# EAGLE design brakeBoard (EAGLE 9.6.2)
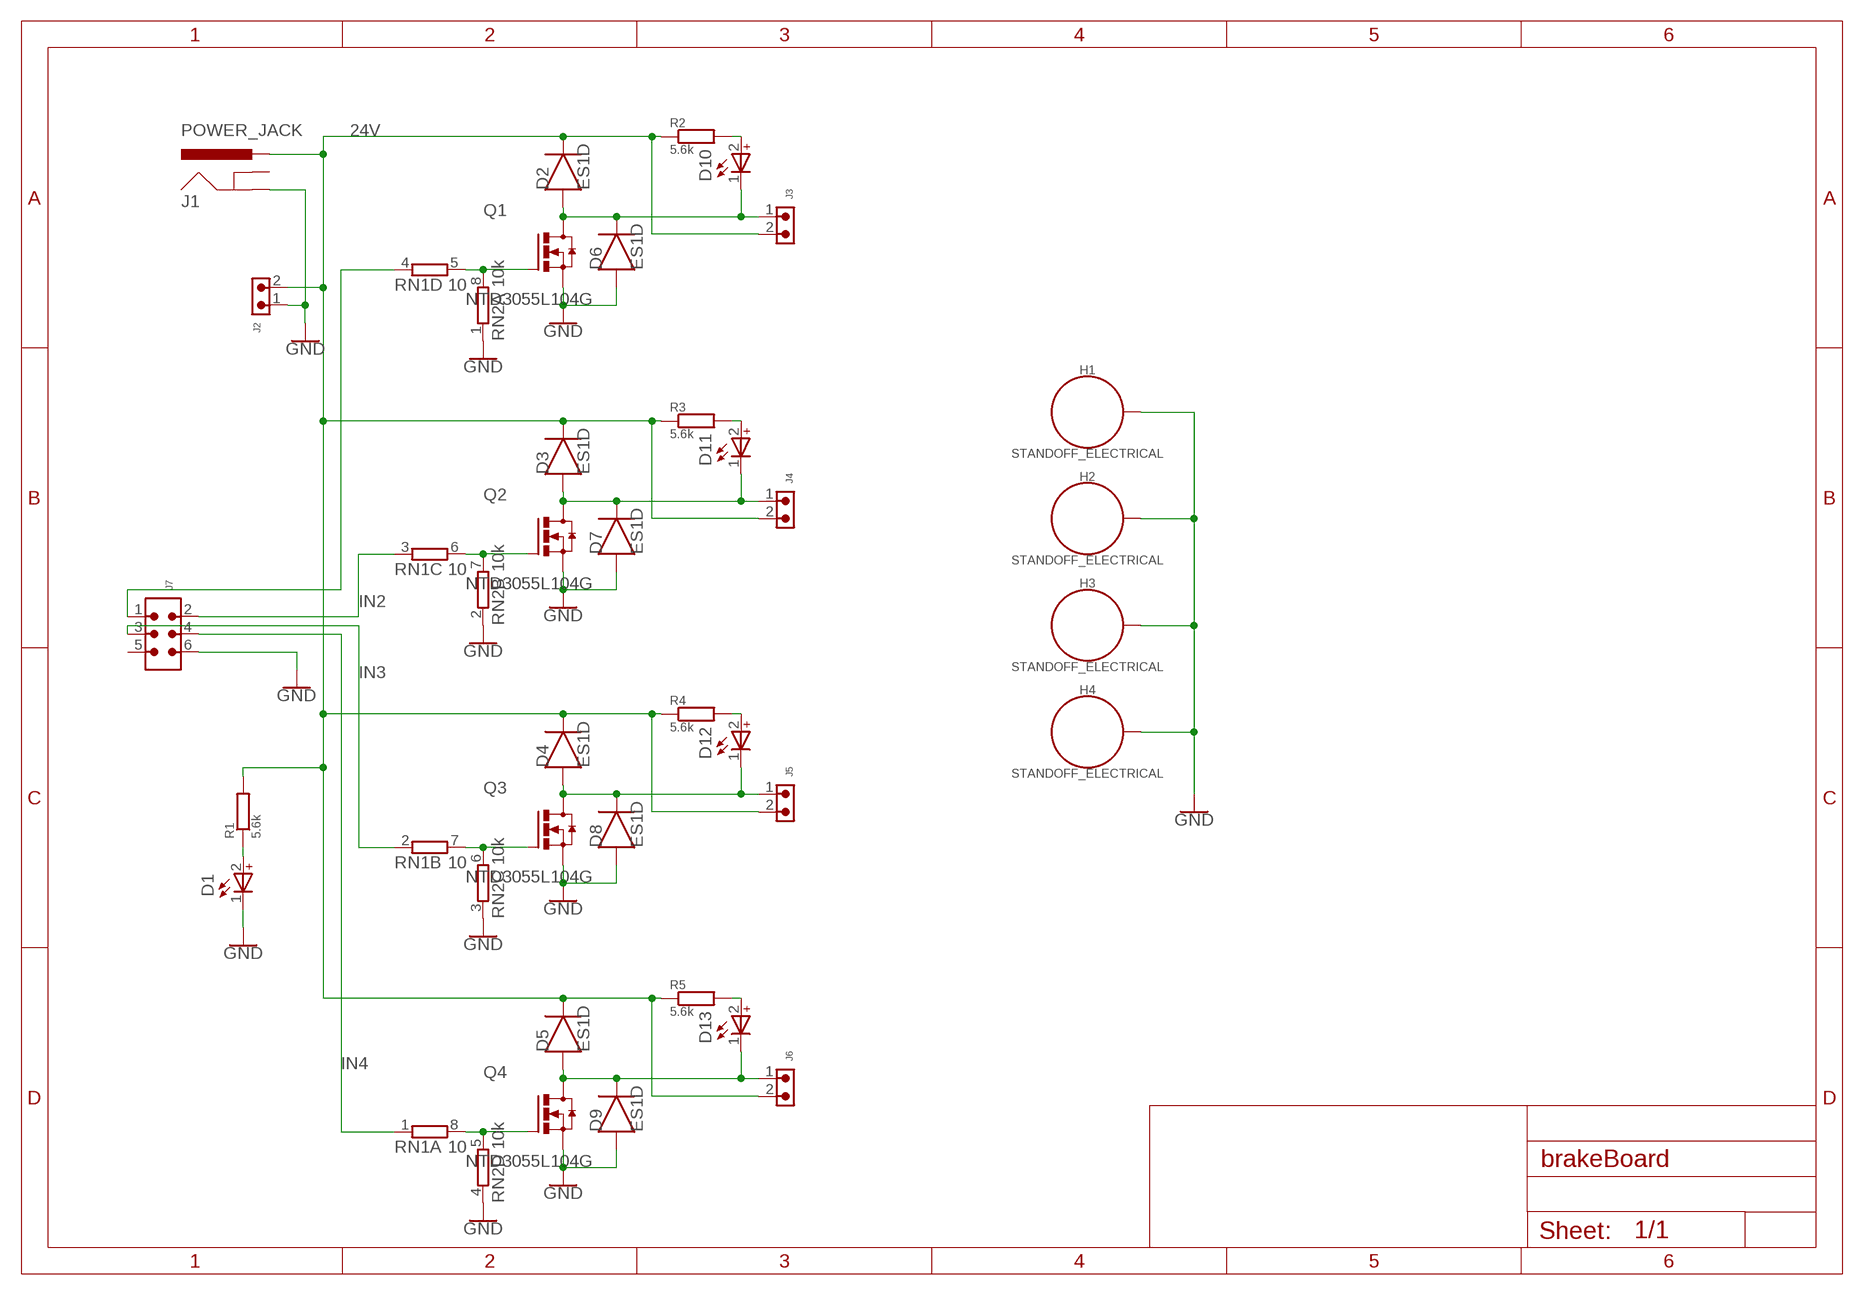
[diagram p0: schematic, sheet 1]

## Parts
D1  WL-SMCD_0603_150060GS55040  [WL-SMCD_0603]
D2  ES1D  DIODE_ES1D_SMA  [DIOM5226X290N]
D3  ES1D  DIODE_ES1D_SMA  [DIOM5226X290N]
D4  ES1D  DIODE_ES1D_SMA  [DIOM5226X290N]
D5  ES1D  DIODE_ES1D_SMA  [DIOM5226X290N]
D6  ES1D  DIODE_ES1D_SMA  [DIOM5226X290N]
D7  ES1D  DIODE_ES1D_SMA  [DIOM5226X290N]
D8  ES1D  DIODE_ES1D_SMA  [DIOM5226X290N]
D9  ES1D  DIODE_ES1D_SMA  [DIOM5226X290N]
D10  WL-SMCD_0603_150060GS55040  [WL-SMCD_0603]
D11  WL-SMCD_0603_150060GS55040  [WL-SMCD_0603]
D12  WL-SMCD_0603_150060GS55040  [WL-SMCD_0603]
D13  WL-SMCD_0603_150060GS55040  [WL-SMCD_0603]
H1  STANDOFF_ELECTRICAL  [STANDOFF-ELECTRICAL]
H2  STANDOFF_ELECTRICAL  [STANDOFF-ELECTRICAL]
H3  STANDOFF_ELECTRICAL  [STANDOFF-ELECTRICAL]
H4  STANDOFF_ELECTRICAL  [STANDOFF-ELECTRICAL]
J1  POWER_JACK  [POWER_JACK_PTH]
J2  691322310002  [691322310002]
J3  691321300002  [691321300002]
J4  691321300002  [691321300002]
J5  691321300002  [691321300002]
J6  691321300002  [691321300002]
J7  6120XX21621_61200621621  [61200621621]
Q1  NTD3055L104G  [DPAK3]
Q2  NTD3055L104G  [DPAK3]
Q3  NTD3055L104G  [DPAK3]
Q4  NTD3055L104G  [DPAK3]
R1  5.6k  R_CHIP-0805(2012-METRIC)  [RESC2012X65]
R2  5.6k  R_CHIP-0805(2012-METRIC)  [RESC2012X65]
R3  5.6k  R_CHIP-0805(2012-METRIC)  [RESC2012X65]
R4  5.6k  R_CHIP-0805(2012-METRIC)  [RESC2012X65]
R5  5.6k  R_CHIP-0805(2012-METRIC)  [RESC2012X65]
RN1  10  4R-NCAY16_LONG_W  [CAY16_LONG_W]
RN2  10k  4R-NCAY16_LONG_W  [CAY16_LONG_W]

## Nets
24V: D2.1(C) D3.1(C) D4.1(C) D5.1(C) J1.PWR J2.2 J3.2 J4.2 J5.2 J6.2 R1.2 R2.1 R3.1 R4.1 R5.1
GND: D1.1(_) D6.2(A) D7.2(A) D8.2(A) D9.2(A) H1.P1 H2.P1 H3.P1 H4.P1 J1.GND J2.1 J7.6 Q1.2(S) Q2.2(S) Q3.2(S) Q4.2(S) RN2.1 RN2.2 RN2.3 RN2.4
IN1: J7.1 RN1.4
IN2: J7.2 RN1.3
IN3: J7.3 RN1.2
IN4: J7.4 RN1.1
N$1: D2.2(A) D6.1(C) D10.1(_) J3.1 Q1.3(D)
N$3: D10.2(+) R2.2
N$4: Q1.1(G) RN1.5 RN2.8
N$5: D3.2(A) D7.1(C) D11.1(_) J4.1 Q2.3(D)
N$7: D11.2(+) R3.2
N$8: D4.2(A) D8.1(C) D12.1(_) J5.1 Q3.3(D)
N$10: D12.2(+) R4.2
N$11: D5.2(A) D9.1(C) D13.1(_) J6.1 Q4.3(D)
N$13: D13.2(+) R5.2
N$14: Q4.1(G) RN1.8 RN2.5
N$15: Q3.1(G) RN1.7 RN2.6
N$16: Q2.1(G) RN1.6 RN2.7
N$17: D1.2(+) R1.1
Unconnected: J1.GNDBREAK J7.5

## Library data of the parts
D1 D10-D13 = Wurth_LEDs_WL-SMCD:WL-SMCD_0603: WL-SMCD SMT Mono-color Chip LED Diffused Characteristics Industrial 0603 platform – 1.6 x 0.8 mm Wide viewing angle 140° Thin version: 0.4 mm Applications Office Automation Home appliances Industrial equipment Front panel backlighting Button backlighting LCD backlighting Navigation backlighting <https://www.we-online.com/catalog/media/o121399v209%20Family_WL-SMCD_0603_thin_0,4mm_150060xx55040.jpg> Details see: https://www.we-online.com/catalog/en/WL-SMCD/ Updated By Yingchun Shan 2020-03-18 2020 (C) Wurth Elektronik; ABSTRAHLWINKEL: 140°; CHIP-TECHNOLOGY: InGaN; DATASHEET-URL: https://www.we-online.com/catalog/datasheet/150060GS55040.pdf; EMITTING-COLOR: Green; I-V-TYP: 430mcd; LAMDA-DOM-TYP: 525nm; LAMDA-PEAK-TYP: 520nm; PART-NUMBER: 150060GS55040; V-F-TYP: 3.2V
D2-D9 = Diode:DIODE_: Diode Rectifier - Popular parts; CATEGORY: Diode; DESCRIPTION: DIODE GEN PURP 200V 1A SMA; MANUFACTURER: ON Semiconductor; SUB-CATEGORY: Rectifier
H1-H4 = SparkFun-Hardware:STANDOFF_ELECTRICAL: Stand Off Drill holes with an electrical connection. For example, use these to ground your board to a chassis. Example SparkFun Products Screw - Phillips Head (1/4", 4-40, 10 pack) <https://www.sparkfun.com/products/10453> (PRT-10453) Screw - Phillips Head (1/2", 4-40, 10 pack) <https://www.sparkfun.com/products/10452> (PRT-10452) Screw - Phillips Head (3/4", 4-40, 10 pack) <https://www.sparkfun.com/products/10451> (PRT-10451) Screw - Phillips Head (1", 4-40, 10 pack) <https://www.sparkfun.com/products/10450> (PRT-10450)
J1 = SparkFun-Connectors:POWER_JACK: Power Jack Connector This is the standard 5.5mm barrel jack for power. The PTH is the most common, proven, reliable, footprint. The Slot footprint only works if the mill layer is transmitted to the PCB fab house so be warned. Here are the connectors we sell at SparkFun: DC Barrel Power Jack/Connector <https://www.sparkfun.com/products/119> (PRT-00119) DC Barrel Power Jack/Connector (SMD) <https://www.sparkfun.com/products/12748> (PRT-12748) DC Barrel Jack Adapter - Breadboard Compatible <https://www.sparkfun.com/products/10811> (PRT-10811) It is used on this SparkFun product (and many, many others): SparkFun RedBoard - Programmed with Arduino <https://www.sparkfun.com/products/12757> (DEV-12757) Also, if you need a mating power supply or connector, please check these out: Wall Adapter Power Supply - 9VDC 650mA <https://www.sparkfun.com/products/298> (TOL-00298) DC Barrel Jack Adapter - Male <https://www.sparkfun.com/products/10287> (PRT-10287); PROD_ID: CONN-08197
J2 = Wurth_Connectors_WR-TBL Pluggable Connector:691322310002: WR-TBL Serie 322 - 3.81 mm Horizontal PCB Header KIND PROPERTIES Pitch 3.81 mm MATERIAL PROPERTIES Insulator Material PA66 Insulator Flammability Rating UL94 V-0 Contact Material Brass Contact Plating Tin GENERAL INFORMATION Operating Temperature -40 up to +105 °C Compliance RoHS ELECTRICAL PROPERTIES IR cULus 10 A IR VDE 10.5 A Working Voltage [cULus] 300 V (AC) Working Voltage [VDE] 300 V (AC) Withstanding Voltage [cULus] 1600 V (AC) Withstanding Voltage [VDE] 2500 V (AC) Contact Resistance [cULus] 20 mΩ Contact Resistance [VDE] 20 mΩ CERTIFICATION cULus Approval E315414 VDE Approval 40023195 <https://www.we-online.com/catalog/media/o33277v209%20Family_WR-TBL_6913223100xx.jpg> Details see: https://www.we-online.com/catalog/en/TBL_3_81_322_HORIZONTAL_PCB_HEADER_6913223100XX/ Updated by Ella Wu 2019-12-20 2019(C) Wurth Elektronik; DATASHEET-URL: https://www.we-online.com/catalog/datasheet/691322310002.pdf; IR-UL: 10A; IR-VDE: 10.5A; MOUNT: THT; PART-NUMBER: 691322310002; PINS: 2; PITCH: 3.81mm; TYPE: Horizontal; WORKING-VOLTAGE-UL: 300V (AC); WORKING-VOLTAGE-VDE: 300V (AC)
J3-J6 = Wurth_Connectors_WR-TBL Pluggable Connector:691321300002: WR-TBL Serie 321 - 3.81 mm Vertical PCB Header KIND PROPERTIES Pitch 3.81 mm MATERIAL PROPERTIES Insulator Material PA66 Insulator Flammability Rating UL94 V-0 Contact Material Brass Contact Plating Tin GENERAL INFORMATION Operating Temperature -40 up to +105 °C Compliance RoHS ELECTRICAL PROPERTIES IR cULus 10 A IR VDE 10.5 A Working Voltage [cULus] 300 V (AC) Working Voltage [VDE] 300 V (AC) Withstanding Voltage [cULus] 1600 V (AC) Withstanding Voltage [VDE] 2500 V (AC) Contact Resistance [cULus] 20 mΩ Contact Resistance [VDE] 20 mΩ CERTIFICATION cULus Approval E315414 VDE Approval 40023195 <https://www.we-online.com/catalog/media/o33275v209%20Family_WR-TBL_6913213000xx.jpg> Details see: https://www.we-online.com/catalog/en/TBL_3_81_321_VERTICAL_PCB_HEADER_6913213000XX/ Updated by Ella Wu 2019-12-18 2019(C) Wurth Elektronik; DATASHEET-URL: https://www.we-online.com/catalog/datasheet/691321300002.pdf; IR-UL: 10A; IR-VDE: 10.5A; MOUNT: THT; PART-NUMBER: 691321300002; PINS: 2; PITCH: 3.81mm; TYPE: Vertical; WORKING-VOLTAGE-UL: 300V (AC); WORKING-VOLTAGE-VDE: 300V (AC)
J7 = Wurth_Connectors_WR-BHD:6120XX21621_61200621621: WR-BHD 2.54 mm Male Box Header KIND PROPERTIES: Pitch 2.54 mm Gender:Male MATERIAL PROPERTIES: Insulator Material:PBT Insulator Flammability Rating UL94 V-0 Insulator Color:Black Contact Material :Copper Alloy Contact Plating :Gold Contact Type: Stamped GENERAL INFORMATION: Operating Temperature:-40 °C up to +125 °C Compliance:RoHS Working Voltage: 250 V (AC) Withstanding Voltage:500 V (AC) Contact Resistance: 20 mΩ Insulation Resistance:1000 MΩ CERTIFICATION: UL Approval:E323964 PACKAGING PROPERTIES Packaging :Tray <https://katalog.we-online.com/media/images/v2/o32884v209%20Family_WR-BHD_6120xx21621.jpg> Details see: https://katalog.we-online.com/en/em/BHD_2_54_MALE_BOX_HEADER_6120XX21621 Updated by Yingchun,Shan 2019-10-29 2019 (C) Würth Elektronik; CONTACT-RESISTANCE: 20mOhm; DATASHEET-URL: https://katalog.we-online.com/em/datasheet/61200621621.pdf; GENDER: Male; IR: 3A; L: 15.28mm; MATES: WR-BHD 2.54mm Female IDC Connector with Strain Relief; MOUNT: THT; PACKAGING: Tray; PART-NUMBER: 61200621621; PINS: 6; PITCH: 2.54mm; TOL-R: max.; TYPE: Straight; WORKING-VOLTAGE: 250V(AC)
Q1-Q4 = Transistor:NTD3055L104G: 12 A, 60 V, Logic Level N−Channel DPAK/IPAK Manufacturer's datasheet <https://www.onsemi.com/pub/Collateral/NTD3055L104-D.PDF>; CREATED_BY: PCBLayout.com; MANUFACTURER: ON SEMICONDUCTORS; MPN: NTD3055L104G; PACKAGE: DPAK-4
R1-R5 = Resistor:R: Resistor Fixed - Generic; CATEGORY: Resistor; SUB-CATEGORY: Fixed
RN1 RN2 = _kantaParts:4R-N: Array Chip Resistor Source: RS Component / Phycomp

## Board
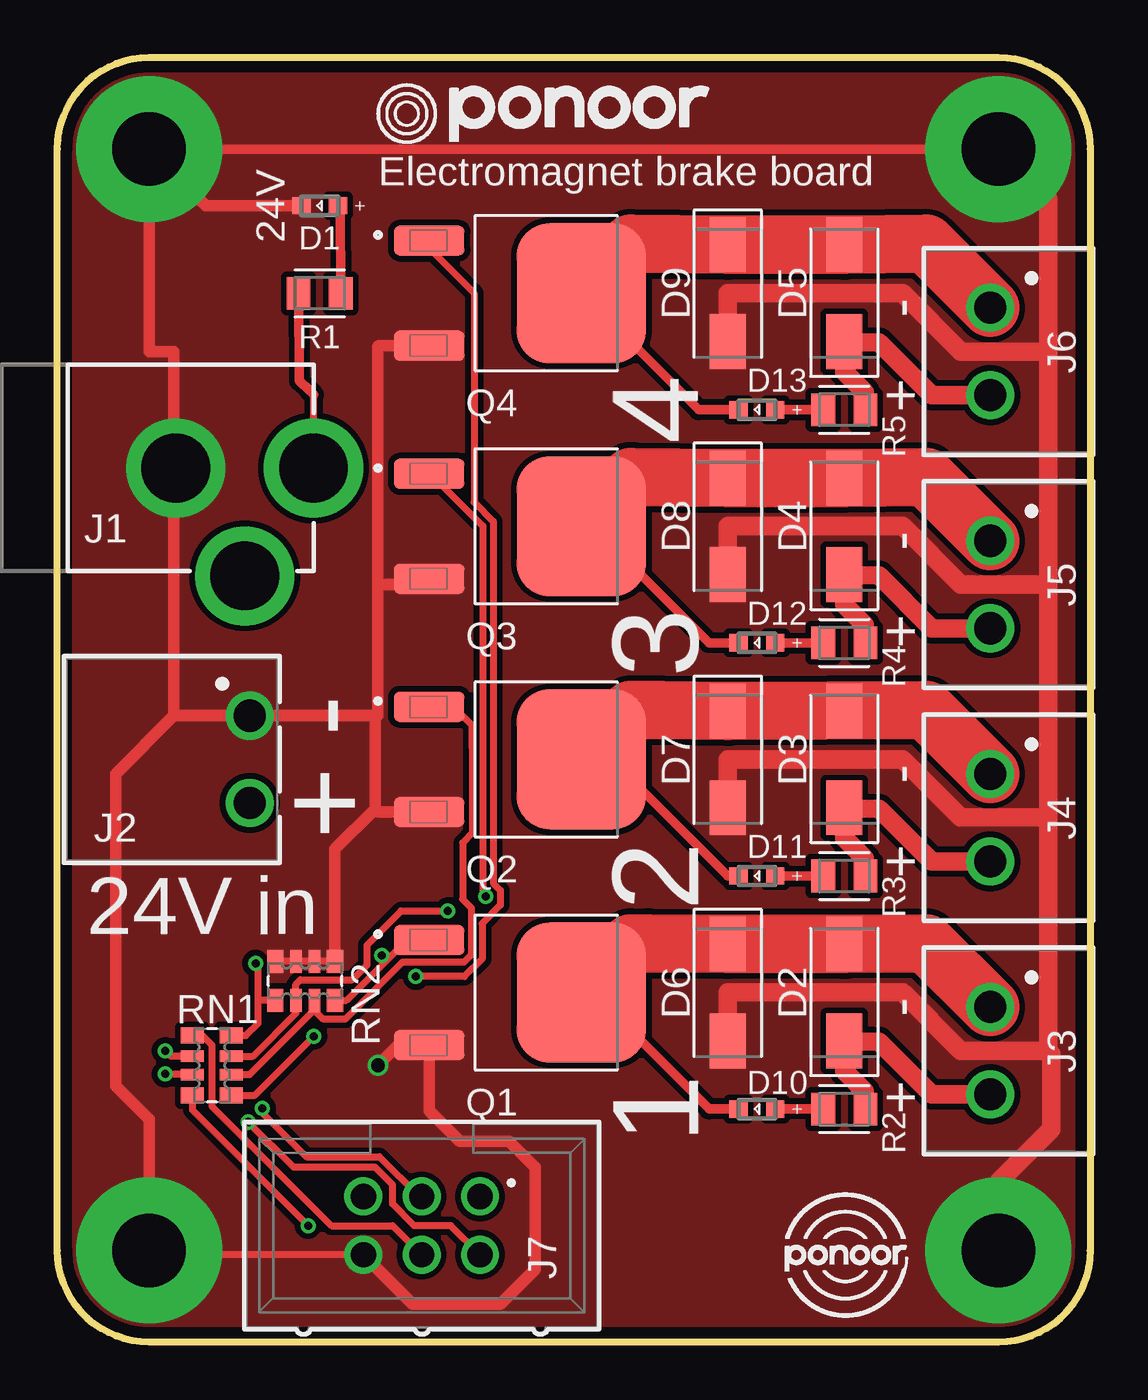
[diagram p1: board, top side]
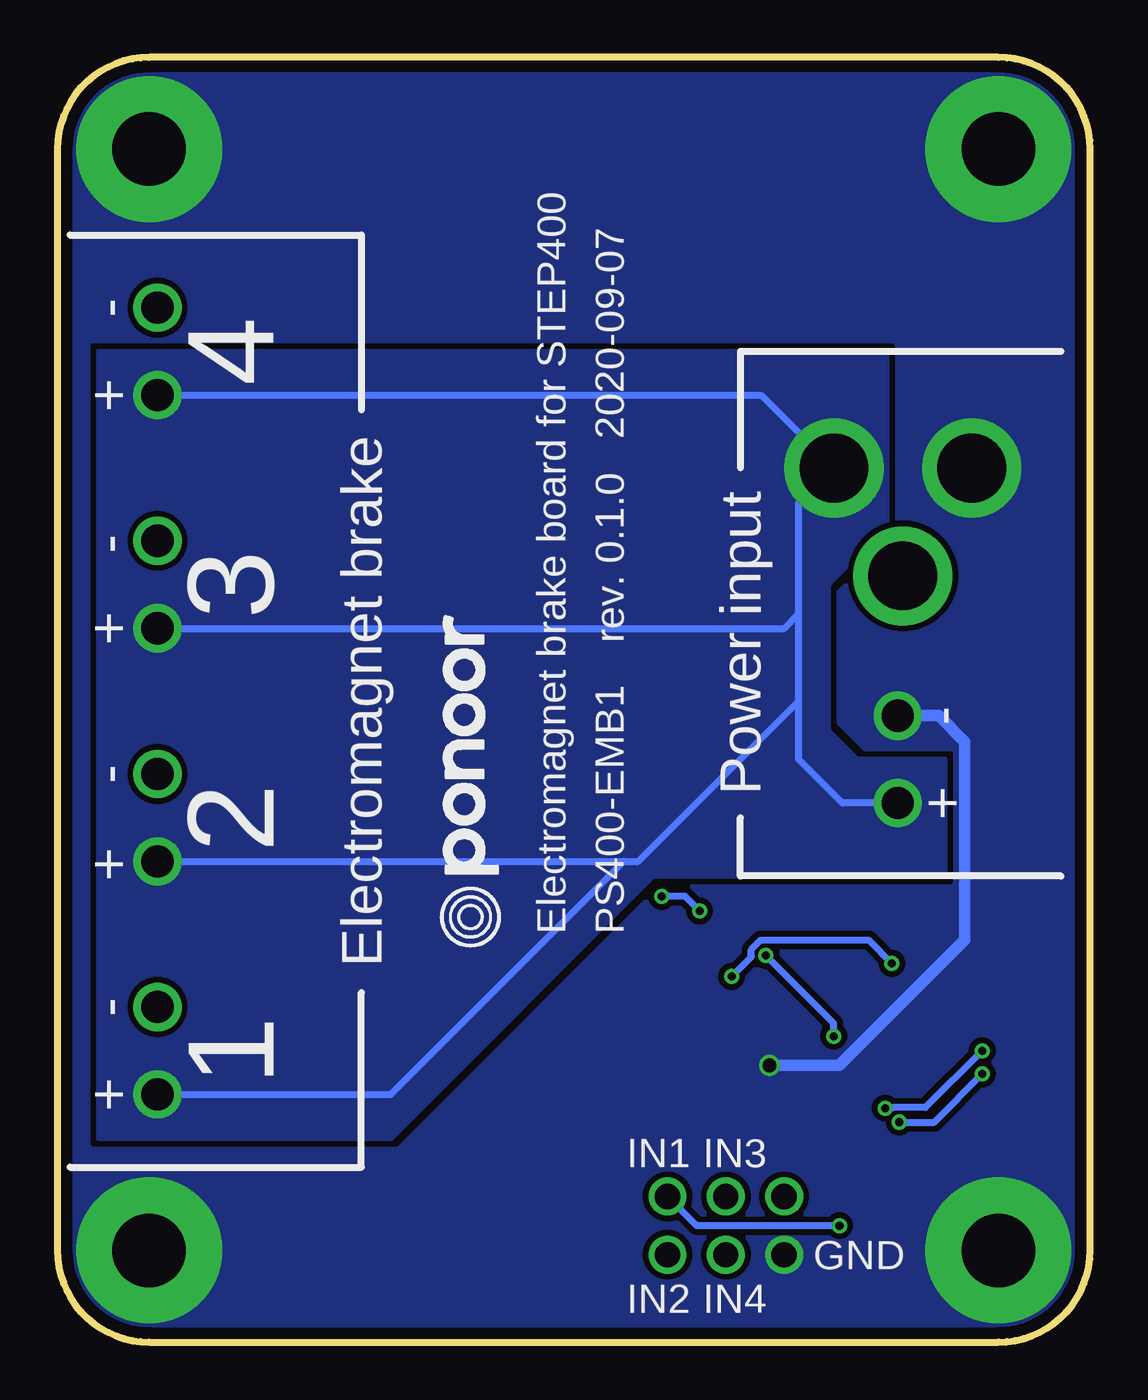
[diagram p2: board, bottom side, seen from below]

Size 45 x 56 mm. Coordinates in mm from the lower left corner, seen from the top.
Outline: 41,0 4,0 arc-90 0,4 0,52 arc-90 4,56 41,56 arc-90 45,52 45,4 arc-90 41,0
Copper layers (1*16): Top 0.035mm / dielectric 1.6mm / Bottom 0.035mm
Design rules "PcbGoGo_2-layer_PCB_eagle_rule": minimum track width 6mil, minimum drill 12mil, track to track 6mil, track to pad 6mil, pad to pad 6mil, via to via 8mil, smd to smd 0mil, copper to edge 20mil, drill to drill 10mil, minimum pad ring 6mil, minimum via ring 6mil, stop-mask expansion 0mil, vias tented up to drill 100mil, thermal gap 10mil

### Footprints (pad centres in the part's own frame; a part is rotated, then mirrored left to right if it is on the bottom)
WL-SMCD_0603 = smd 0.8 x 0.75: 1 -0.8,0; 2 0.8,0
DIOM5226X290N = smd 2.392 x 1.565: 1 -2.108,0; 2 2.108,0
STANDOFF-ELECTRICAL = drill 3.2 pad 6.35: P1 0,0
POWER_JACK_PTH = drill 2.997 pad 4.318: GND 0,7.7; GNDBREAK 4.7,10.7; PWR 0,13.7
691322310002 = drill 1.4: 1 -1.905,0; 2 1.905,0
691321300002 = drill 1.4: 1 -1.905,0; 2 1.905,0
61200621621 = drill 1.1: 1 -2.54,-1.27; 2 -2.54,1.27; 3 0,-1.27; 4 0,1.27; 5 2.54,-1.27; 6 2.54,1.27
DPAK3 = smd 1.31 x 3.08: 1 -2.29,-4.12; 2 2.29,-4.12 | smd 6.09 x 5.63: 3 0,2.51
RESC2012X65 = smd 1.031 x 1.42: 1 -0.919,0; 2 0.919,0
CAY16_LONG_W = smd 0.7 x 1: 1 -1.3,-0.85; 4 1.3,-0.85; 5 1.3,0.85; 8 -1.3,0.85 | smd 0.5 x 1: 2 -0.4,-0.85; 3 0.4,-0.85; 6 0.4,0.85; 7 -0.4,0.85

### Placement (x,y rotation side)
D1  11.43,49.53 0 top
D2  34.29,15.24 90 top
D3  34.29,25.4 90 top
D4  34.29,35.56 90 top
D5  34.29,45.72 90 top
D6  29.21,15.24 270 top
D7  29.21,25.4 270 top
D8  29.21,35.56 270 top
D9  29.21,45.72 270 top
D10  30.48,10.16 0 top
D11  30.48,20.32 0 top
D12  30.48,30.48 0 top
D13  30.48,40.64 0 top
H1  4,4 0 top
H2  41,4 0 top
H3  41,52 0 top
H4  4,52 0 top
J1  -2.54,38.1 270 top
J2  8.38,25.4 270 top
J3  40.64,12.7 270 top
J4  40.64,22.86 270 top
J5  40.64,33.02 270 top
J6  40.64,43.18 270 top
J7  15.88,5.08 180 top
Q1  20.32,15.24 270 top
Q2  20.32,25.4 270 top
Q3  20.32,35.56 270 top
Q4  20.32,45.72 270 top
R1  11.43,45.72 180 top
R2  34.29,10.16 180 top
R3  34.29,20.32 180 top
R4  34.29,30.48 180 top
R5  34.29,40.64 180 top
RN1  6.73,12.06 270 top
RN2  10.79,15.75 180 top
U$1  [PONOOR_LOGO_6MM]  34.29,3.81 0 top
U$2  [PONOOR_TEXT_15MM]  13.21,51.94 0 top
U$3  [PONOOR_TEXT_15MM]  25.4,16.51 90 bottom

### Tracks (layer width: path | path; a pad name or v marks a point on that pad's centre or on a via)
24V
  Top 0.305: 11.06,41.39 10.99,41.47 | J1.PWR 11.16,41.29
  Top 0.406: R1.2 10.54,41.91 10.99,41.47 11.16,41.29
  Top 0.813: J6.2 38.1,41.27 35.8,43.57 D5.1 34.29,42.3 35.18,41.41 R5.1 | J5.2 38.1,31.11 35.8,33.41 D4.1 34.29,32.14 35.18,31.25 R4.1 | J4.2 38.1,20.95 35.8,23.25 D3.1 34.29,21.98 35.18,21.09 R3.1 | J3.2 38.1,10.79 35.8,13.09 D2.1 34.29,11.82 35.18,10.93 R2.1
  Bottom 0.305: J2.2 10.79,23.5 12.7,25.4 12.7,27.94 | 12.7,27.94 12.7,31.75 | 12.7,31.75 12.7,36.56 J1.PWR 14.34,41.27 J6.2 | J5.2 13.34,31.11 12.7,31.75 | J4.2 20.32,20.95 | 20.32,20.95 19.68,20.95 12.7,27.94 | J3.2 30.48,10.79 20.32,20.95
  pour Bottom (isolate 0.254, rank 3, no thermals): 43.18,43.18 8.89,43.18 8.89,35.56 11.43,33.02 11.43,26.67 10.16,25.4 6.35,25.4 6.35,20.32 19.05,20.32 30.48,8.89 43.18,8.89
GND  (via drill 0.6)
  Top 0.305: RN2.1 RN2.2 RN2.3 RN2.4 | J7.6 4.19,3.81 H1.P1 | J1.GND 5.08,38.1
  Top 0.406: H4.P1 H3.P1
  Top 0.508: 13.97,33.02 13.97,43.4 14,43.43 Q4.2 | 13.97,33.02 13.97,27.3 | 13.97,27.3 J2.1 5.08,27.3 | 5.08,27.3 5.08,38.1 5.08,43.18 4,43.18 H4.P1 6.47,49.53 D1.1 | Q3.2 15.95,33.02 13.97,33.02 | Q2.2 13.97,23.11 13.84,23.24 | 13.84,23.24 13.84,27.18 13.97,27.3 | J7.6 15.49,1.65 19.3,1.65 20.83,3.17 20.83,7.62 19.68,8.76 17.53,8.76 16.2,10.09 Q1.2 14.86,12.95 v13.97,12.06 | H1.P1 4,9.72 2.54,11.18 2.54,24.77 5.08,27.3 | RN2.1 12.1,21.49 13.84,23.24
  Top 0.813: D9.2 29.21,45.72 36.83,45.72 39.37,43.18 43.18,43.18 | H3.P1 43.18,49.82 43.18,43.18 | 43.18,12.7 43.18,22.86 | 43.18,22.86 43.18,33.02 | 43.18,33.02 43.18,43.18 | D6.2 29.21,15.24 36.83,15.24 39.37,12.7 43.18,12.7 | D7.2 29.21,25.4 36.83,25.4 39.37,22.86 43.18,22.86 | D8.2 29.21,35.56 36.83,35.56 39.37,33.02 43.18,33.02 | H2.P1 41,6.96 43.31,9.27 43.31,12.57 43.18,12.7
  Bottom 0.508: v13.97,12.06 10.92,12.06 5.46,17.53 5.46,26.16 6.6,27.3 J2.1
  pour Top (isolate 0.254, rank 4, no thermals): -1,-1 46,-1 46,57 -1,57
  pour Bottom (isolate 0.254, rank 5, no thermals): -2,-2 -2,58 47,58 47,-2
IN1  (via drill 0.35)
  Top 0.305: RN1.4 5.88,10.12 v10.92,5.08
  Bottom 0.305: J7.1 17.14,5.08 v10.92,5.08
IN2  (via drill 0.35)
  Top 0.305: J7.2 17.14,5.08 15.55,5.08 14.61,6.02 14.61,6.86 13.84,7.62 10.29,7.62 v8.32,9.59 | v4.7,11.68 5.86,11.68 RN1.3
  Bottom 0.305: v8.32,9.59 6.79,9.59 v4.7,11.68
IN3  (via drill 0.35)
  Top 0.305: RN1.2 4.93,12.46 v4.7,12.7 | v8.93,10.2 8.93,9.99 10.85,8.08 14.03,8.08 15.76,6.35 J7.3
  Bottom 0.305: v8.93,10.2 8.61,10.2 8.58,10.22 7.18,10.22 v4.7,12.7
IN4
  Top 0.305: RN1.1 6.32,13.37 6.73,12.95 6.73,10.29 11.94,5.08 14.61,5.08 J7.4
N$1
  Top 0.305: Q1.3 23.32,15.24 23.45,15.11
  Top 0.406: D10.1 28.4,10.16 23.45,15.11
  Top 2.54: J3.1 37.85,17.39 D2.2 D6.1 25.74,17.39 24.98,17.39 Q1.3
N$3
  Top 0.406: R2.2 D10.2
N$4  (via drill 0.35)
  Top 0.305: RN2.8 12.6,14.9 14.47,16.77 | 14.47,16.77 15.1,17.4 16.07,17.4 Q1.1 | RN1.5 8.61,10.77 v11.18,13.34 | v14.13,16.86 14.39,16.86 14.47,16.77
  Bottom 0.305: v11.18,13.34 11.18,13.9 v14.13,16.86
N$5
  Top 0.305: Q2.3 24.13,25.4
  Top 0.406: D11.1 29.21,20.32 24.13,25.4 | D3.2 D7.1
  Top 2.54: J4.1 37.85,27.55 D7.1 26.28,27.55 24.98,27.55 Q2.3
N$7
  Top 0.406: D11.2 R3.2
N$8
  Top 0.305: Q3.3 22.86,35.56
  Top 0.406: D12.1 28.4,30.48 24.13,34.75 23.4,35.48
  Top 2.54: 22.86,35.56 24.13,34.29 24.13,34.75 | J5.1 37.85,37.71 D4.2 D8.1 25.01,37.71 24.98,37.71 Q3.3
N$10
  Top 0.406: D12.2 R4.2
N$11
  Top 0.305: Q4.3 22.86,45.72
  Top 0.406: 22.86,45.72 27.94,40.64 D13.1
  Top 2.54: J6.1 37.85,47.87 D5.2 D9.1 25.01,47.87 24.98,47.87 Q4.3
N$13
  Top 0.406: D13.2 R5.2
N$14  (via drill 0.35)
  Top 0.305: RN1.8 8.22,13.37 8.73,13.88 8.73,14.86 | v15.62,15.94 17.74,15.94 18.5,16.7 18.5,18.25 19.3,19.05 19.3,19.69 19,20 19,35.77 18.16,36.61 18.16,45.72 16.2,47.68 Q4.1 | v8.64,16.51 8.73,16.41 8.73,14.86 | RN2.5 8.77,14.9 8.73,14.86
  Bottom 0.305: v15.62,15.94 14.76,16.8 14.76,17.12 14.36,17.53 9.65,17.53 v8.64,16.51
N$15  (via drill 0.35)
  Top 0.305: v18.67,19.43 18.54,19.56 18.54,35.56 | 18.54,35.58 18.54,35.56 | RN1.7 8.53,12.46 10.39,14.33 RN2.6 10.39,15.6 10.59,15.79 12.85,15.79 13.5,16.44 13.5,17.31 14.98,18.8 v17.02,18.8 | 18.54,35.56 16.25,37.85 Q3.1
  Bottom 0.305: v17.02,18.8 17.65,19.43 v18.67,19.43
N$16
  Top 0.305: RN2.7 11.2,14.48 | 11.2,14.48 11.2,14.46 11.56,14.09 12.57,14.09 15.05,16.57 17.72,16.57 18.05,16.89 18.05,18.91 17.65,19.3 17.65,21.76 18.09,22.19 18.09,25.4 18.09,25.88 18.09,26.87 17.27,27.69 Q2.1 | 11.2,14.48 11.19,14.48 8.37,11.66 RN1.6
N$17
  Top 0.406: D1.2 12.32,49.44 R1.1

### Text on the board
tPlace: 24V | Electromagnet brake board | - | 4 | + | - | + | 3 | - | - | + | + | 24V in | 2 | - | + | 1
bPlace: - | 4 | + | 2020-09-07 | - | 3 | + | Power input | rev. 0.1.0 | Electromagnet brake | - | - | + | 2 | + | PS400-EMB1 | Electromagnet brake board for STEP400 | - | 1 | + | IN3 | IN1 | GND | IN4 | IN2